# Altium schematic sheet MEM.SchDoc
size A; SheetNumber: 6; SheetTotal: 6
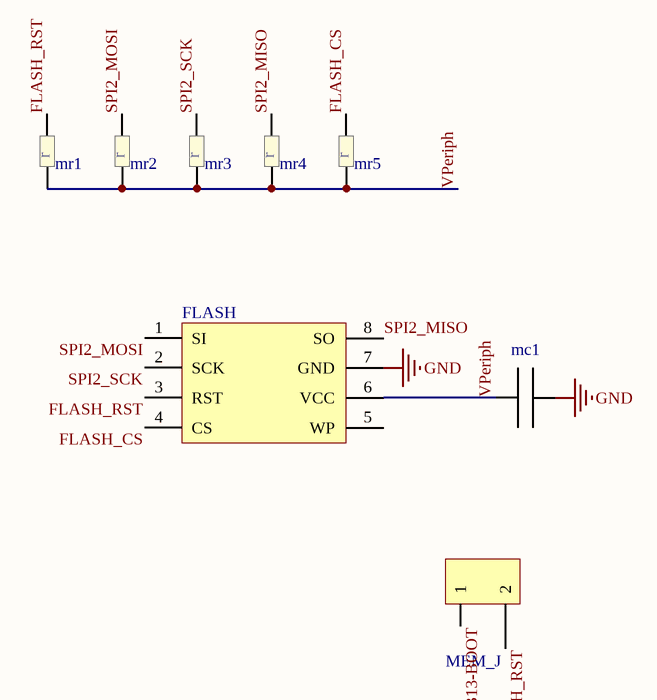
[diagram p0: MEM.SchDoc]

## Parts
FLASH  SPI-FLASH  [abr_ic_spi_flash_3d]  (value not drawn)
mc1  100nf  [abr_cap_0805_3d]  (value not drawn)
MEM_J  pin header 2mm  [abr_ph_2x1_2mm_3d_male]  (value not drawn)
mr1  10k  [abr_res_0805_3d]  (value not drawn)
mr2  10k  [abr_res_0805_3d]  (value not drawn)
mr3  10k  [abr_res_0805_3d]  (value not drawn)
mr4  10k  [abr_res_0805_3d]  (value not drawn)
mr5  10k  [abr_res_0805_3d]  (value not drawn)

## Nets
GND: FLASH.7(GND) mc1.0
FLASH_CS: FLASH.4(CS) mr5.1
FLASH_RST: FLASH.3(RST) MEM_J.2 mr1.1
PB13-BOOT: MEM_J.1
SPI2_MISO: FLASH.8(SO) mr4.1
SPI2_MOSI: FLASH.1(SI) mr2.1
SPI2_SCK: FLASH.2(SCK) mr3.1
VPeriph: FLASH.6(VCC) mc1.1 mr1.0 mr2.0 mr3.0 mr4.0 mr5.0

Not connected (* = marked no-connect by the designer): FLASH 5(WP)

## Notes on the sheet
- (in symbol abr_res_0805) r

## Library data of the parts
FLASH = abr_ic_at_45db161_e
mc1 = abr_cap_0805
MEM_J = abr_2x1_2mm
mr1-mr5 = abr_res_0805